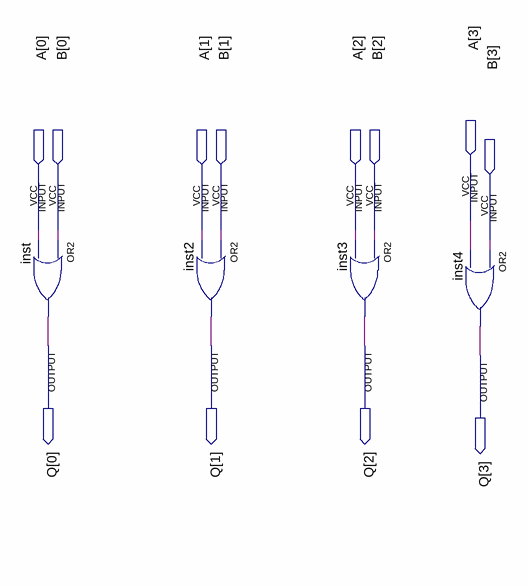
[diagram p0: schematic sheet]
// Quartus schematic OR_4BIT.bdf as structural Verilog: 4 symbols, 12 pins
module OR_4BIT (
  input  [3:0] A,
  input  [3:0] B,
  output [3:0] Q
);

  or inst (Q[0], B[0], A[0]);
  or inst2 (Q[1], B[1], A[1]);
  or inst3 (Q[2], B[2], A[2]);
  or inst4 (Q[3], B[3], A[3]);
endmodule
